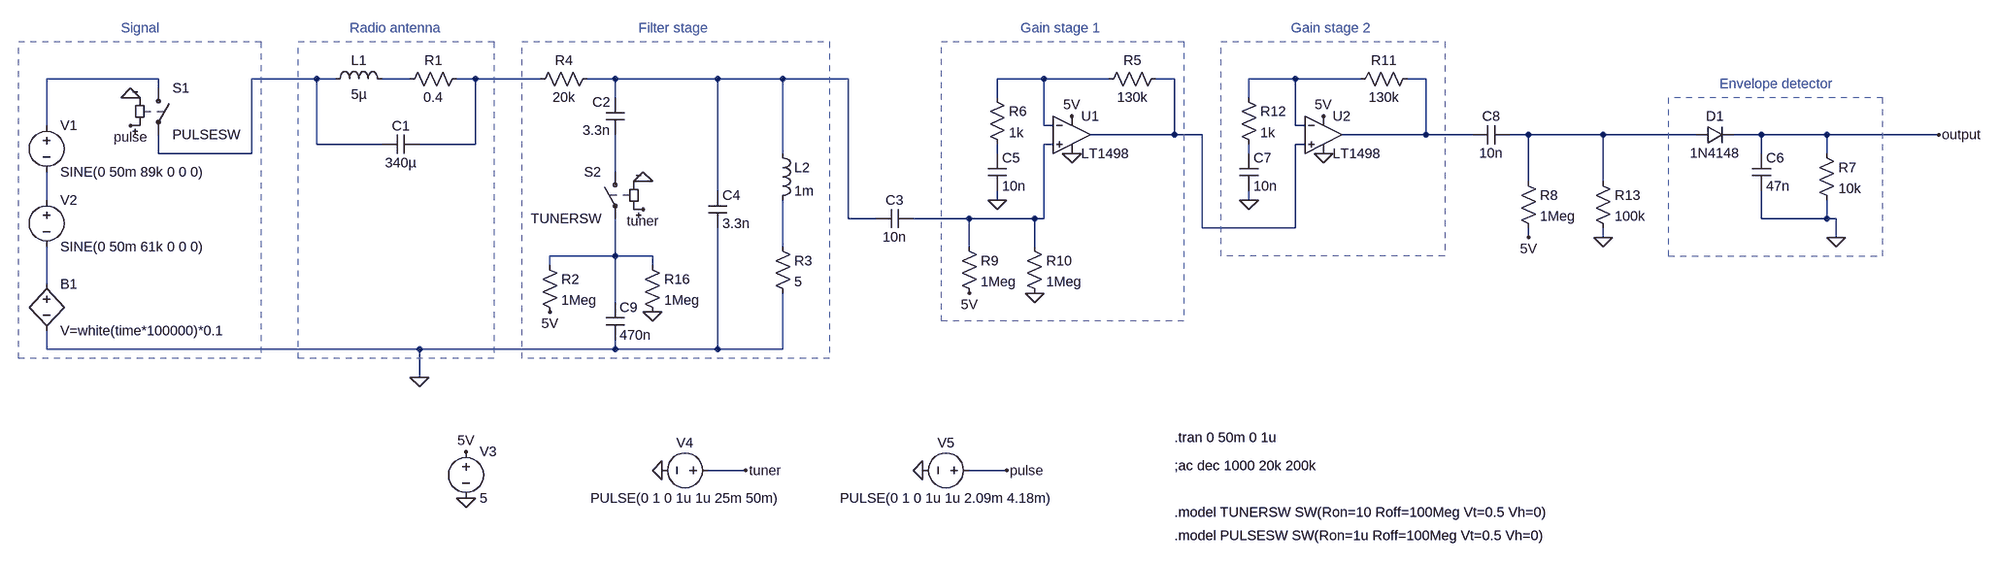
[diagram p0: schematic Radio v1.7.asc]
Radio v1.7.asc, the LTspice schematic file:
Version 4
SHEET 1 3872 896
WIRE 224 -64 32 -64
WIRE 496 -64 384 -64
WIRE 528 -64 496 -64
WIRE 656 -64 608 -64
WIRE 768 -64 736 -64
WIRE 880 -64 768 -64
WIRE 1008 -64 960 -64
WIRE 1184 -64 1008 -64
WIRE 1296 -64 1184 -64
WIRE 1408 -64 1296 -64
WIRE 1744 -64 1664 -64
WIRE 1856 -64 1744 -64
WIRE 1968 -64 1936 -64
WIRE 2176 -64 2096 -64
WIRE 2288 -64 2176 -64
WIRE 2400 -64 2368 -64
WIRE 224 -48 224 -64
WIRE 1008 -32 1008 -64
WIRE 1664 -32 1664 -64
WIRE 2096 -32 2096 -64
WIRE 32 16 32 -64
WIRE 1744 16 1744 -64
WIRE 1760 16 1744 16
WIRE 2176 16 2176 -64
WIRE 2192 16 2176 16
WIRE 1968 32 1968 -64
WIRE 1968 32 1824 32
WIRE 2016 32 1968 32
WIRE 2400 32 2400 -64
WIRE 2400 32 2256 32
WIRE 2480 32 2400 32
WIRE 2576 32 2544 32
WIRE 2704 32 2576 32
WIRE 2864 32 2704 32
WIRE 2976 32 2928 32
WIRE 3088 32 2976 32
WIRE 3280 32 3088 32
WIRE 496 48 496 -64
WIRE 608 48 496 48
WIRE 768 48 768 -64
WIRE 768 48 672 48
WIRE 1760 48 1744 48
WIRE 2192 48 2176 48
WIRE 224 64 224 32
WIRE 384 64 384 -64
WIRE 384 64 224 64
WIRE 1296 64 1296 -64
WIRE 1664 64 1664 48
WIRE 2096 64 2096 48
WIRE 2976 64 2976 32
WIRE 3088 64 3088 32
WIRE 1008 96 1008 32
WIRE 2576 112 2576 32
WIRE 2704 112 2704 32
WIRE 1184 128 1184 -64
WIRE 32 144 32 96
WIRE 1664 144 1664 128
WIRE 2096 144 2096 128
WIRE 1408 176 1408 -64
WIRE 1456 176 1408 176
WIRE 1616 176 1520 176
WIRE 1728 176 1616 176
WIRE 1744 176 1744 48
WIRE 1744 176 1728 176
WIRE 2976 176 2976 128
WIRE 3088 176 3088 144
WIRE 3088 176 2976 176
WIRE 3104 176 3088 176
WIRE 2016 192 2016 32
WIRE 2176 192 2176 48
WIRE 2176 192 2016 192
WIRE 2576 208 2576 192
WIRE 2704 208 2704 192
WIRE 3104 208 3104 176
WIRE 1296 224 1296 144
WIRE 1616 224 1616 176
WIRE 1728 224 1728 176
WIRE 1008 240 1008 176
WIRE 1008 240 896 240
WIRE 1072 240 1008 240
WIRE 896 256 896 240
WIRE 1072 256 1072 240
WIRE 32 288 32 224
WIRE 1008 320 1008 240
WIRE 32 400 32 368
WIRE 672 400 32 400
WIRE 1008 400 1008 384
WIRE 1008 400 672 400
WIRE 1184 400 1184 192
WIRE 1184 400 1008 400
WIRE 1296 400 1296 304
WIRE 1296 400 1184 400
WIRE 672 448 672 400
WIRE 1232 608 1168 608
WIRE 1680 608 1616 608
FLAG 672 448 0
FLAG 176 -32 0
FLAG 176 16 pulse
FLAG 752 656 0
FLAG 752 576 5V
FLAG 1536 608 0
FLAG 1088 608 0
FLAG 1232 608 tuner
FLAG 1680 608 pulse
FLAG 1056 112 0
FLAG 1056 160 tuner
FLAG 1792 64 0
FLAG 1664 144 0
FLAG 3104 208 0
FLAG 3280 32 output
FLAG 1616 304 5V
FLAG 1728 304 0
FLAG 1792 0 5V
FLAG 896 336 5V
FLAG 1072 336 0
FLAG 2224 64 0
FLAG 2096 144 0
FLAG 2224 0 5V
FLAG 2576 208 5V
FLAG 2704 208 0
SYMBOL voltage 32 0 R0
WINDOW 123 24 124 Left 2
WINDOW 39 24 124 Left 2
SYMATTR InstName V1
SYMATTR Value SINE(0 50m 89k 0 0 0)
SYMBOL cap 608 64 R270
WINDOW 0 32 32 VTop 2
WINDOW 3 0 32 VBottom 2
SYMATTR InstName C1
SYMATTR Value 340µ
SYMBOL ind 512 -48 R270
WINDOW 0 32 56 VTop 2
WINDOW 3 5 56 VBottom 2
SYMATTR InstName L1
SYMATTR Value 5µ
SYMATTR SpiceLine Rser=0
SYMBOL res 640 -48 R270
WINDOW 0 32 56 VTop 2
WINDOW 3 0 56 VBottom 2
SYMATTR InstName R1
SYMATTR Value 0.4
SYMBOL voltage 32 128 R0
WINDOW 123 24 124 Left 2
WINDOW 39 24 124 Left 2
SYMATTR InstName V2
SYMATTR Value SINE(0 50m 61k 0 0 0)
SYMBOL sw 224 -64 R0
SYMATTR InstName S1
SYMATTR Value PULSESW
SYMBOL voltage 752 560 R0
WINDOW 123 0 0 Left 0
WINDOW 39 0 0 Left 0
SYMATTR InstName V3
SYMATTR Value 5
SYMBOL voltage 1184 608 R90
WINDOW 0 -32 56 VBottom 2
WINDOW 3 32 56 VTop 2
WINDOW 123 0 0 Left 0
WINDOW 39 0 0 Left 0
SYMATTR InstName V4
SYMATTR Value PULSE(0 1 0 1u 1u 25m 50m)
SYMBOL voltage 1632 608 R90
WINDOW 0 -32 56 VBottom 2
WINDOW 3 32 56 VTop 2
WINDOW 123 0 0 Left 0
WINDOW 39 0 0 Left 0
SYMATTR InstName V5
SYMATTR Value PULSE(0 1 0 1u 1u 2.09m 4.18m)
SYMBOL cap 1024 32 R180
WINDOW 0 24 56 Left 2
WINDOW 3 24 8 Left 2
SYMATTR InstName C2
SYMATTR Value 3.3n
SYMBOL sw 1008 80 M0
SYMATTR InstName S2
SYMATTR Value TUNERSW
SYMBOL cap 1520 160 R90
WINDOW 0 0 32 VBottom 2
WINDOW 3 32 32 VTop 2
SYMATTR InstName C3
SYMATTR Value 10n
SYMBOL cap 1168 128 R0
SYMATTR InstName C4
SYMATTR Value 3.3n
SYMBOL ind 1280 48 R0
SYMATTR InstName L2
SYMATTR Value 1m
SYMBOL res 1280 208 R0
SYMATTR InstName R3
SYMATTR Value 5
SYMBOL res 976 -80 R90
WINDOW 0 0 56 VBottom 2
WINDOW 3 32 56 VTop 2
SYMATTR InstName R4
SYMATTR Value 20k
SYMBOL res 1952 -80 R90
WINDOW 0 0 56 VBottom 2
WINDOW 3 32 56 VTop 2
SYMATTR InstName R5
SYMATTR Value 130k
SYMBOL res 1648 -48 R0
SYMATTR InstName R6
SYMATTR Value 1k
SYMBOL cap 1648 64 R0
SYMATTR InstName C5
SYMATTR Value 10n
SYMBOL cap 2960 64 R0
SYMATTR InstName C6
SYMATTR Value 47n
SYMBOL res 3072 48 R0
SYMATTR InstName R7
SYMATTR Value 10k
SYMBOL diode 2864 48 R270
WINDOW 0 32 32 VTop 2
WINDOW 3 0 32 VBottom 2
SYMATTR InstName D1
SYMATTR Value 1N4148
SYMATTR Description Schottky diode
SYMATTR Type schottky
SYMBOL OpAmps\\LT1498 1792 -32 R0
SYMATTR InstName U1
SYMBOL res 1600 208 R0
SYMATTR InstName R9
SYMATTR Value 1Meg
SYMBOL res 1712 208 R0
SYMATTR InstName R10
SYMATTR Value 1Meg
SYMBOL res 880 240 R0
SYMATTR InstName R2
SYMATTR Value 1Meg
SYMBOL res 1056 240 R0
SYMATTR InstName R16
SYMATTR Value 1Meg
SYMBOL cap 992 320 R0
SYMATTR InstName C9
SYMATTR Value 470n
SYMBOL res 2384 -80 R90
WINDOW 0 0 56 VBottom 2
WINDOW 3 32 56 VTop 2
SYMATTR InstName R11
SYMATTR Value 130k
SYMBOL res 2080 -48 R0
SYMATTR InstName R12
SYMATTR Value 1k
SYMBOL cap 2080 64 R0
SYMATTR InstName C7
SYMATTR Value 10n
SYMBOL OpAmps\\LT1498 2224 -32 R0
SYMATTR InstName U2
SYMBOL res 2560 96 R0
SYMATTR InstName R8
SYMATTR Value 1Meg
SYMBOL res 2688 96 R0
SYMATTR InstName R13
SYMATTR Value 100k
SYMBOL cap 2544 16 R90
WINDOW 0 0 32 VBottom 2
WINDOW 3 32 32 VTop 2
SYMATTR InstName C8
SYMATTR Value 10n
SYMBOL bv 32 272 R0
SYMATTR InstName B1
SYMATTR Value V=white(time*100000)*0.1
TEXT 552 -152 Left 2 ;Radio antenna
TEXT 160 -152 Left 2 ;Signal
TEXT 1968 552 Left 2 !.tran 0 50m 0 1u
TEXT 1968 680 Left 2 !.model TUNERSW SW(Ron=10 Roff=100Meg Vt=0.5 Vh=0)
TEXT 1968 720 Left 2 !.model PULSESW SW(Ron=1u Roff=100Meg Vt=0.5 Vh=0)
TEXT 1048 -152 Left 2 ;Filter stage
TEXT 2904 -56 Left 2 ;Envelope detector
TEXT 1704 -152 Left 2 ;Gain stage 1
TEXT 2168 -152 Left 2 ;Gain stage 2
TEXT 1968 600 Left 2 !;ac dec 1000 20k 200k
RECTANGLE Normal 400 416 -16 -128 2
RECTANGLE Normal 800 416 464 -128 2
RECTANGLE Normal 2816 240 3184 -32 2
RECTANGLE Normal 1984 352 1568 -128 2
RECTANGLE Normal 1376 416 848 -128 2
RECTANGLE Normal 2432 240 2048 -128 2

The netlist it stands for:
* Radio v1.7.asc
V1 N001 N015 SINE(0 50m 89k 0 0 0)
C1 N002 N004 340µ
L1 N002 N003 5µ Rser=0
R1 N003 N004 0.4
V2 N015 N018 SINE(0 50m 61k 0 0 0)
S1 N001 N002 pulse 0 PULSESW
V3 5V 0 5
V4 tuner 0 PULSE(0 1 0 1u 1u 25m 50m)
V5 pulse 0 PULSE(0 1 0 1u 1u 2.09m 4.18m)
C2 N014 N005 3.3n
S2 N014 N017 tuner 0 TUNERSW
C3 N011 N005 10n
C4 N005 0 3.3n
L2 N005 N016 1m
R3 N016 0 5
R4 N005 N004 20k
R5 N007 N006 130k
R6 N006 N012 1k
C5 N012 0 10n
C6 output 0 47n
R7 output 0 10k
D1 N010 output 1N4148
XU1 N011 N006 5V 0 N007 LT1498  ; pins In+ In- V+ V- OUT
R9 N011 5V 1Meg
R10 N011 0 1Meg
R2 N017 5V 1Meg
R16 N017 0 1Meg
C9 N017 0 470n
R11 N009 N008 130k
R12 N008 N013 1k
C7 N013 0 10n
XU2 N007 N008 5V 0 N009 LT1498  ; pins In+ In- V+ V- OUT
R8 N010 5V 1Meg
R13 N010 0 100k
C8 N010 N009 10n
B1 N018 0 V=white(time*100000)*0.1
.model D D
.lib standard.dio
* Radio antenna
* Signal
.tran 0 50m 0 1u
.model TUNERSW SW(Ron=10 Roff=100Meg Vt=0.5 Vh=0)
.model PULSESW SW(Ron=1u Roff=100Meg Vt=0.5 Vh=0)
* Filter stage
* Envelope detector
* Gain stage 1
* Gain stage 2
;ac dec 1000 20k 200k
.lib LTC.lib
.backanno
.end